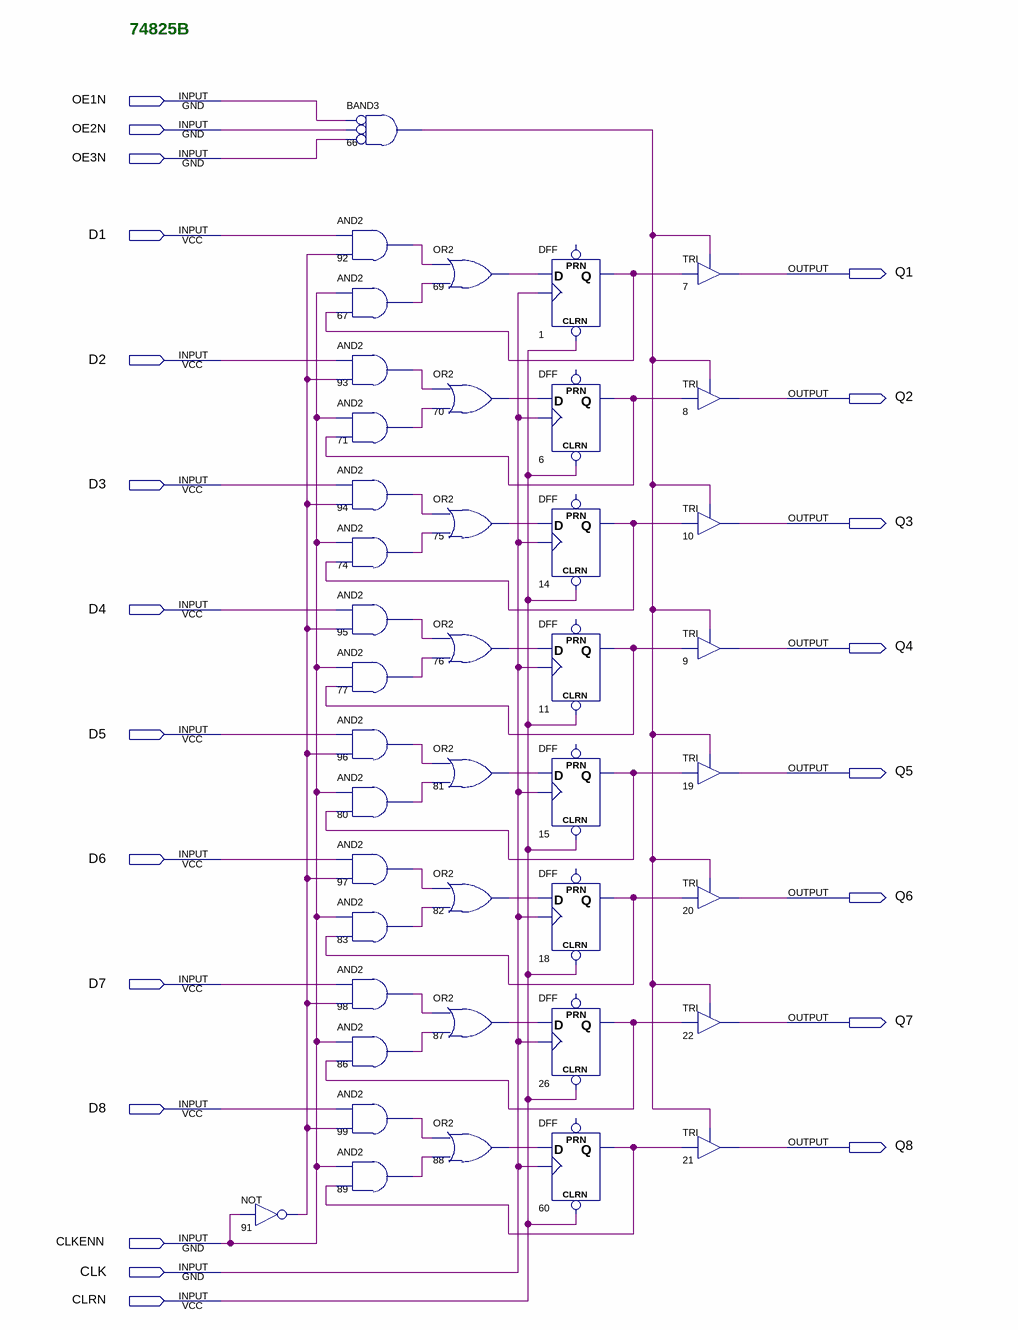
[diagram p0: schematic sheet]
// Quartus schematic 74825b.bdf as structural Verilog: 42 symbols, 22 pins
module \74825b  (
  input  OE1N,
  input  OE2N,
  input  OE3N,
  input  D1,
  input  D2,
  input  D3,
  input  D4,
  input  D5,
  input  D6,
  input  D7,
  input  D8,
  input  CLKENN,
  input  CLK,
  input  CLRN,
  output Q1,
  output Q2,
  output Q3,
  output Q4,
  output Q5,
  output Q6,
  output Q7,
  output Q8
);

  wire n1_q, n6_q, n11_q, n14_q, n15_q, n18_q, n26_q, n60_q, n66_out, n67_out, n69_out, n70_out, n71_out,
       n74_out, n75_out, n76_out, n77_out, n80_out, n81_out, n82_out, n83_out, n86_out, n87_out, n88_out,
       n89_out, n91_out, n92_out, n93_out, n94_out, n95_out, n96_out, n97_out, n98_out, n99_out;

  not u_91 (n91_out, CLKENN);
  and u_66 (n66_out, ~OE1N, ~OE2N, ~OE3N);  // BAND3
  and u_92 (n92_out, D1, n91_out);
  and u_67 (n67_out, CLKENN, n1_q);
  and u_93 (n93_out, D2, n91_out);
  and u_71 (n71_out, CLKENN, n6_q);
  and u_94 (n94_out, D3, n91_out);
  and u_74 (n74_out, CLKENN, n14_q);
  and u_95 (n95_out, D4, n91_out);
  and u_77 (n77_out, CLKENN, n11_q);
  and u_96 (n96_out, D5, n91_out);
  and u_80 (n80_out, CLKENN, n15_q);
  and u_97 (n97_out, D6, n91_out);
  and u_83 (n83_out, CLKENN, n18_q);
  and u_98 (n98_out, D7, n91_out);
  and u_86 (n86_out, CLKENN, n26_q);
  and u_99 (n99_out, D8, n91_out);
  and u_89 (n89_out, CLKENN, n60_q);
  or u_69 (n69_out, n92_out, n67_out);
  or u_70 (n70_out, n93_out, n71_out);
  or u_75 (n75_out, n94_out, n74_out);
  or u_76 (n76_out, n95_out, n77_out);
  or u_81 (n81_out, n96_out, n80_out);
  or u_82 (n82_out, n97_out, n83_out);
  or u_87 (n87_out, n98_out, n86_out);
  or u_88 (n88_out, n99_out, n89_out);
  DFF u_1 (.CLRN(CLRN), .CLK(CLK), .D(n69_out), .Q(n1_q));  // open: PRN
  DFF u_6 (.CLRN(CLRN), .CLK(CLK), .D(n70_out), .Q(n6_q));  // open: PRN
  DFF u_14 (.CLRN(CLRN), .CLK(CLK), .D(n75_out), .Q(n14_q));  // open: PRN
  DFF u_11 (.CLRN(CLRN), .CLK(CLK), .D(n76_out), .Q(n11_q));  // open: PRN
  DFF u_15 (.CLRN(CLRN), .CLK(CLK), .D(n81_out), .Q(n15_q));  // open: PRN
  DFF u_18 (.CLRN(CLRN), .CLK(CLK), .D(n82_out), .Q(n18_q));  // open: PRN
  DFF u_26 (.CLRN(CLRN), .CLK(CLK), .D(n87_out), .Q(n26_q));  // open: PRN
  DFF u_60 (.CLRN(CLRN), .CLK(CLK), .D(n88_out), .Q(n60_q));  // open: PRN
  TRI u_7 (.IN(n1_q), .OE(n66_out), .OUT(Q1));
  TRI u_8 (.IN(n6_q), .OE(n66_out), .OUT(Q2));
  TRI u_10 (.IN(n14_q), .OE(n66_out), .OUT(Q3));
  TRI u_9 (.IN(n11_q), .OE(n66_out), .OUT(Q4));
  TRI u_19 (.IN(n15_q), .OE(n66_out), .OUT(Q5));
  TRI u_20 (.IN(n18_q), .OE(n66_out), .OUT(Q6));
  TRI u_22 (.IN(n26_q), .OE(n66_out), .OUT(Q7));
  TRI u_21 (.IN(n60_q), .OE(n66_out), .OUT(Q8));

  // Notes on the sheet:
  //   74825B
endmodule
